# EAGLE design BoomOtter (EAGLE 7.4.0)
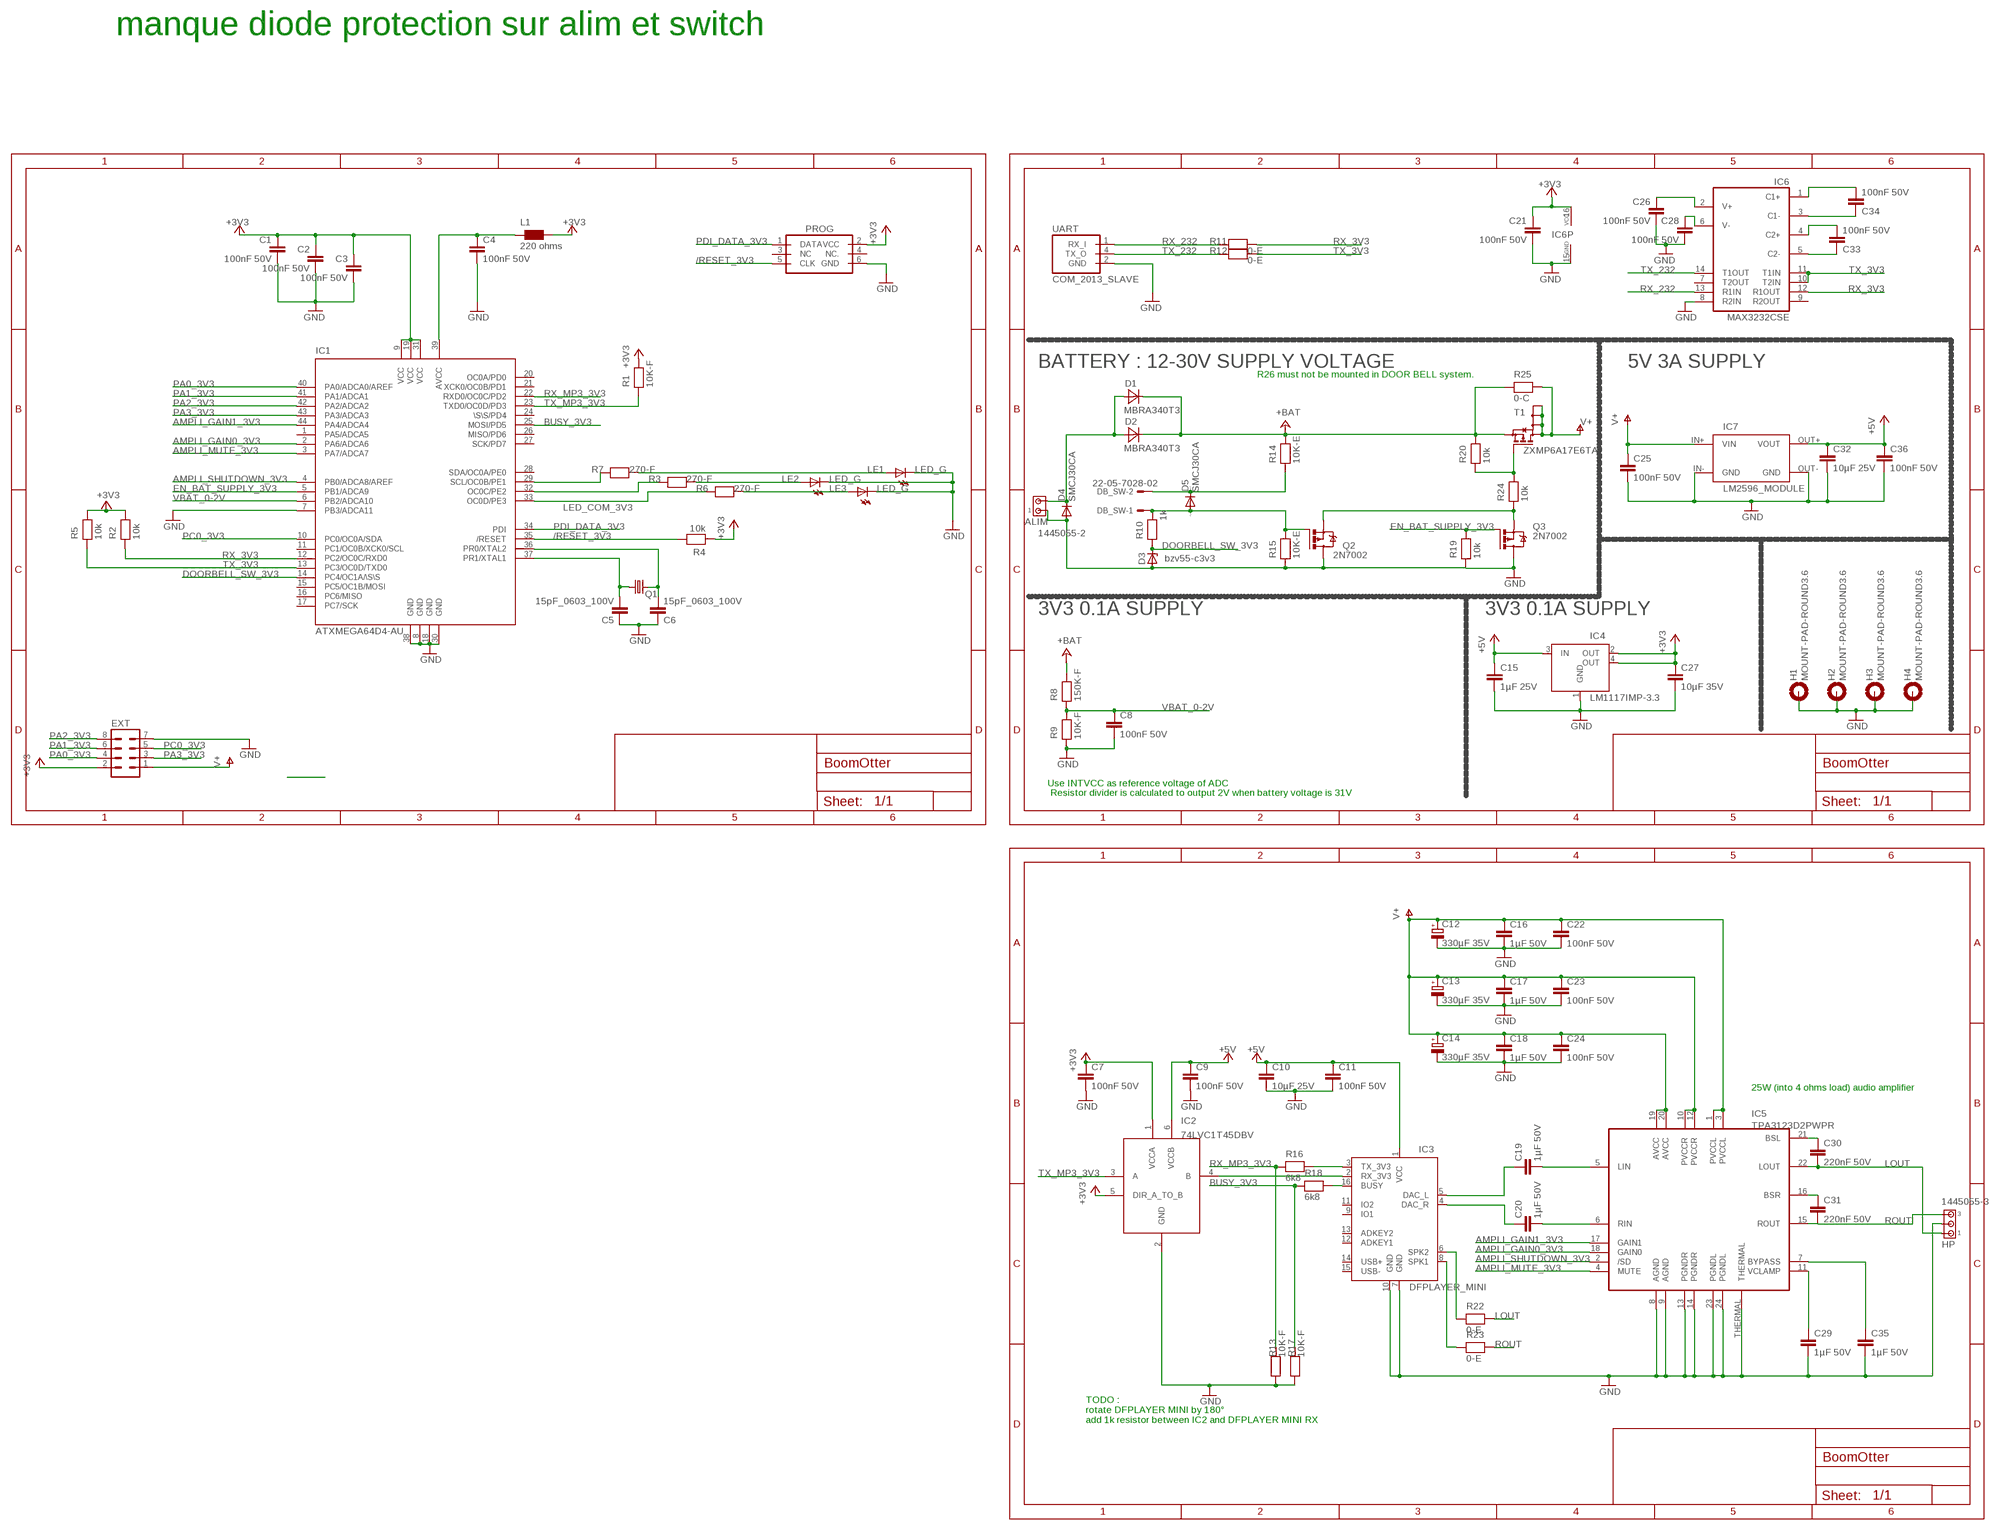
[diagram p0: schematic, sheet 1]

## Parts
ALIM  1445055-2  [1445055-2]
C1  100nF 50V  100NF-F  [C0603]
C2  100nF 50V  100NF-F  [C0603]
C3  100nF 50V  100NF-F  [C0603]
C4  100nF 50V  100NF-F  [C0603]
C5  15pF_0603_100V  15PF-F  [C0603]
C6  15pF_0603_100V  15PF-F  [C0603]
C7  100nF 50V  100NF-F  [C0603]
C8  100nF 50V  100NF-E  [C0805]
C9  100nF 50V  100NF-F  [C0603]
C10  10µF 25V  10UF-C_25V  [C1210]
C11  100nF 50V  100NF-F  [C0603]
C12  330µF 35V  330UF  [PANASONIC_G]
C13  330µF 35V  330UF  [PANASONIC_G]
C14  330µF 35V  330UF  [PANASONIC_G]
C15  1µF 25V  1UFD_25V  [C1206]
C16  1µF 50V  1UFD_50V  [C1206]
C17  1µF 50V  1UFD_50V  [C1206]
C18  1µF 50V  1UFD_50V  [C1206]
C19  1µF 50V  1UFD_50V  [C1206]
C20  1µF 50V  1UFD_50V  [C1206]
C21  100nF 50V  100NF-F  [C0603]
C22  100nF 50V  100NF-F  [C0603]
C23  100nF 50V  100NF-F  [C0603]
C24  100nF 50V  100NF-F  [C0603]
C25  100nF 50V  100NF-E  [C0805]
C26  100nF 50V  100NF-F  [C0603]
C27  10µF 35V  10UF-C_35V  [C1210]
C28  100nF 50V  100NF-F  [C0603]
C29  1µF 50V  1UFD_50V  [C1206]
C30  220nF 50V  220NF-F_50V  [C0805]
C31  220nF 50V  220NF-F_50V  [C0805]
C32  10µF 25V  10UF-C_25V  [C1210]
C33  100nF 50V  100NF-F  [C0603]
C34  100nF 50V  100NF-F  [C0603]
C35  1µF 50V  1UFD_50V  [C1206]
C36  100nF 50V  100NF-F  [C0603]
D1  MBRA340T3  [SMA]
D2  MBRA340T3  [SMA]
D3  bzv55-c3v3  BZV55-C3V3SOD80C  [SOD80C]
D4  SMCJ30CA  DIODE-SMC  [SMC]
D5  SMCJ30CA  DIODE-SMC  [SMC]
DB_SW  22-05-7028-02  [7395-02]
EXT  MA04-2  [MA04-2]
H1  MOUNT-PAD-ROUND3.6  [3,6-PAD]
H2  MOUNT-PAD-ROUND3.6  [3,6-PAD]
H3  MOUNT-PAD-ROUND3.6  [3,6-PAD]
H4  MOUNT-PAD-ROUND3.6  [3,6-PAD]
HP  1445055-3  [1445055-3]
IC1  ATXMEGA64D4-AU  [TQFP44]
IC2  74LVC1T45DBV  [SOT23-6]
IC3  DFPLAYER_MINI  [DFPLAYER_MINI]
IC4  LM1117IMP-3.3  [SOT223]
IC5  TPA3123D2PWPR  [HTSSOP24]
IC6  MAX3232CSE  [SO16]
IC7  LM2596_MODULE  [LM2596]
L1  220 ohms  FERRITE_220OHMS  [R0603]
LE1  LED_G  [CHIP-LED0805]
LE2  LED_G  [CHIP-LED0805]
LE3  LED_G  [CHIP-LED0805]
PROG  PDI_ATMELL  [ML6L]
Q1  CRYSTAL_16MHZ_5032  [CRYSTAL_5032]
Q2  2N7002  [SOT23]
Q3  2N7002  [SOT23]
R1  10K-F  [R0603]
R2  10k  10K-F  [R0603]
R3  270-F  [R0603]
R4  10k  10K-F  [R0603]
R5  10k  10K-F  [R0603]
R6  270-F  [R0603]
R7  270-F  [R0603]
R8  150K-F  [R0603]
R9  10K-F  [R0603]
R10  1k  1K-F  [R0603]
R11  0-E  [R0805]
R12  0-E  [R0805]
R13  10K-F  [R0603]
R14  10K-E  [R0805]
R15  10K-E  [R0805]
R16  6k8  6K8-F  [R0603]
R17  10K-F  [R0603]
R18  6k8  6K8-F  [R0603]
R19  10k  10K-F  [R0603]
R20  10k  10K-F  [R0603]
R22  0-E  [R0805]
R23  0-E  [R0805]
R24  10k  10K-F  [R0603]
R25  0-C  [R1210]
T1  ZXMP6A17E6TA  [SOT26]
UART  COM_2013_SLAVE  [MICROMATCH-4_SMD]

## Nets
+3V3: C1.1 C2.1 C3.1 C7.1 C21.1 C27.1 EXT.2 IC1.9(VCC) IC1.19(VCC) IC1.31(VCC) IC2.1(VCCA) IC2.5(DIR_A_TO_B) IC4.2(OUT) IC4.4(OUT) IC6.16(VCC) L1.2 PROG.2(VCC) R1.2 R2.2 R4.1 R5.2
+5V: C9.1 C10.1 C11.1 C15.1 C32.1 C36.1 IC2.6(VCCB) IC3.1(VCC) IC4.3(IN) IC7.OUT+(VOUT)
+BAT: D1.C D2.C R8.2 R14.2 R20.2 R25.1 T1.4(S)
/RESET_3V3: IC1.35(/RESET) PROG.5(CLK) R4.2
AMPLI_GAIN0_3V3: IC1.2(PA6/ADCA6) IC5.18(GAIN0)
AMPLI_GAIN1_3V3: IC1.44(PA4/ADCA4) IC5.17(GAIN1)
AMPLI_MUTE_3V3: IC1.3(PA7/ADCA7) IC5.4(MUTE)
AMPLI_SHUTDOWN_3V3: IC1.4(PB0/ADCA8/AREF) IC5.2(/SD)
BUSY_3V3: IC1.25(MOSI/PD5) R17.2 R18.1
DOORBELL_SW_3V3: D3.C IC1.14(PC4/OC1A/\S\S) R10.1
EN_BAT_SUPPLY_3V3: IC1.5(PB1/ADCA9) Q3.1(G) R19.2
GND: ALIM.1 C1.2 C2.2 C3.2 C4.2 C5.1 C6.1 C7.2 C8.2 C9.2 C10.2 C11.2 C12.- C13.- C14.- C15.2 C16.2 C17.2 C18.2 C21.2 C22.2 C23.2 C24.2 C25.2 C26.2 C27.2 C28.2 C29.2 C32.2 C35.2 C36.2 D3.A D4.A EXT.7 H1.B3,6(MOUNT) H2.B3,6(MOUNT) H3.B3,6(MOUNT) H4.B3,6(MOUNT) HP.2 IC1.7(PB3/ADCA11) IC1.8(GND) IC1.18(GND) IC1.30(GND) IC1.38(GND) IC2.2(GND) IC3.7(GND) IC3.10(GND) IC4.1(GND) IC5.8(AGND) IC5.9(AGND) IC5.13(PGNDR) IC5.14(PGNDR) IC5.23(PGNDL) IC5.24(PGNDL) IC5.THERMAL IC6.8(R2IN) IC6.15(GND) IC7.IN-(GND) IC7.OUT-(GND) LE1.C LE2.C LE3.C PROG.6(GND) Q2.2(D) Q3.2(D) R9.1 R13.1 R15.1 R17.1 R19.1 UART.2(GND)
LED_COM_3V3: IC1.29(SCL/OC0B/PE1) R7.1
LOUT: C30.2 HP.1 IC5.22(LOUT) R22.2
N$1: C34.1 IC6.1(C1+)
N$2: LE2.A R3.2
N$3: ALIM.2 D1.A D2.A D4.C
N$4: LE3.A R6.2
N$5: C34.2 IC6.3(C1-)
N$6: C33.1 IC6.4(C2+)
N$7: LE1.A R7.2
N$8: Q2.3(S) Q3.3(S) R24.1
N$9: IC1.32(OC0C/PE2) R3.1
N$10: IC1.33(OC0D/PE3) R6.1
N$11: C26.1 IC6.2(V+)
N$12: C19.1 IC3.5(DAC_L)
N$13: C28.1 IC6.6(V-)
N$14: C6.2 IC1.36(PR0/XTAL2) Q1.2
N$15: D5.C DB_SW.2 R14.1
N$16: C4.1 IC1.39(AVCC) L1.1
N$17: D5.A DB_SW.1 Q2.1(G) R10.2 R15.2
N$19: C20.1 IC3.4(DAC_R)
N$20: C20.2 IC5.6(RIN)
N$21: C19.2 IC5.5(LIN)
N$22: C30.1 IC5.21(BSL)
N$23: IC3.3(TX_3V3) R16.2
N$24: C33.2 IC6.5(C2-)
N$25: C31.1 IC5.16(BSR)
N$27: C35.1 IC5.7(BYPASS)
N$28: IC3.6(SPK2) R22.1
N$29: IC3.8(SPK1) R23.1
N$30: IC3.16(BUSY) R18.2
N$33: IC2.4(B) IC3.2(RX_3V3)
N$45: C5.2 IC1.37(PR1/XTAL1) Q1.1
N$128: R20.1 R24.2 T1.3(G)
PA0_3V3: EXT.4 IC1.40(PA0/ADCA0/AREF)
PA1_3V3: EXT.6 IC1.41(PA1/ADCA1)
PA2_3V3: EXT.8 IC1.42(PA2/ADCA2)
PA3_3V3: EXT.3 IC1.43(PA3/ADCA3)
PC0_3V3: EXT.5 IC1.10(PC0/OC0A/SDA)
PDI_DATA_3V3: IC1.34(PDI) PROG.1(DATA)
ROUT: C31.2 HP.3 IC5.15(ROUT) R23.2
RX_3V3: IC1.12(PC2/OC0C/RXD0) IC6.12(R1OUT) R2.1 R11.2
RX_232: IC6.13(R1IN) R11.1 UART.1(RX_I)
RX_MP3_3V3: IC1.22(RXD0/OC0C/PD2) R13.2 R16.1
TX_3V3: IC1.13(PC3/OC0D/TXD0) IC6.10(T2IN) IC6.11(T1IN) R5.1 R12.2
TX_232: IC6.14(T1OUT) R12.1 UART.4(TX_O)
TX_MP3_3V3: IC1.23(TXD0/OC0D/PD3) IC2.3(A) R1.1
V+: C12.+ C13.+ C14.+ C16.1 C17.1 C18.1 C22.1 C23.1 C24.1 C25.1 EXT.1 IC5.1(PVCCL) IC5.3(PVCCL) IC5.10(PVCCR) IC5.12(PVCCR) IC5.19(AVCC) IC5.20(AVCC) IC7.IN+(VIN) R25.2 T1.1(D) T1.2(D) T1.5(D) T1.6(D)
VBAT_0-2V: C8.1 IC1.6(PB2/ADCA10) R8.1 R9.2
VCLAMP: C29.1 IC5.11(VCLAMP)
Unconnected: IC1.1(PA5/ADCA5) IC1.11(PC1/OC0B/XCK0/SCL) IC1.15(PC5/OC1B/MOSI) IC1.16(PC6/MISO) IC1.17(PC7/SCK) IC1.20(OC0A/PD0) IC1.21(XCK0/OC0B/PD1) IC1.24(\S\S/PD4) IC1.26(MISO/PD6) IC1.27(SCK/PD7) IC1.28(SDA/OC0A/PE0) IC3.9(IO1) IC3.11(IO2) IC3.12(ADKEY1) IC3.13(ADKEY2) IC3.14(USB+) IC3.15(USB-) IC6.7(T2OUT) IC6.9(R2OUT) PROG.3(NC) PROG.4(NC.)

## Notes on the sheet
- manque diode protection sur alim et switch
- BATTERY : 12-30V SUPPLY VOLTAGE | 5V 3A SUPPLY
- R26 must not be mounted in DOOR BELL system.
- 3V3 0.1A SUPPLY | 3V3 0.1A SUPPLY
- Use INTVCC as reference voltage of ADC
- Resistor divider is calculated to output 2V when battery voltage is 31V
- 25W (into 4 ohms load) audio amplifier
- TODO : 
  rotate DFPLAYER MINI by 180°
  add 1k resistor between IC2 and DFPLAYER MINI RX

## Library data of the parts
ALIM = robotter_connector:1445055-2: Micro MATE-N-LOK Connectors grid 1.5 mm Source: ENG_CD_1445055_A.pdf; MOUSER: 571-2-1445055-2; RS: 495-9580
C1-C4 C7 C9 C11 C21-C24 C26 C28 C33 C34 C36 = robotter_capacitor:100NF; MOUSER: 81-GRM188F51H104ZA01; RS: 723-5534
C5 C6 = robotter_capacitor:15PF; MOUSER: 581-06031A150K4T2A; RS: 147-421
C8 C25 = robotter_capacitor:100NF; MOUSER: 81-GRM40Y104Z50D; RS: 220-7966
C10 C32 = robotter_capacitor:10UF; MOUSER: 963-TMK316BJ106KL-T; RS: 766-1185
C12-C14 = robotter_capacitor:330UF; MANUFACTURER: EEEFK1V331P; MOUSER: 667-EEE-FK1V331P; RS: 708-3475
C15 = robotter_capacitor:1UF; MOUSER: 810-C3216X7R1E105K-6; RS: 740-7574
C16-C20 C29 C35 = robotter_capacitor:1UF; RS: 601-0334
C27 = robotter_capacitor:10UF; MOUSER: 963-GMK325BJ106MN-T; RS: 758-3325
C30 C31 = robotter_capacitor:220NF; RS: 600-9378
D1 D2 = robotter_diode:MBRA340T3: Surface Mount Schottky Power Rectifier Source: http://www.onsemi.com/pub_link/Collateral/MBRA340T3-D.PDF; MOUSER: 863-MBRA340T3G; RS: 688-0502
D3 = robotter_diode:BZV55-C3V3: Z-Diode; MOUSER: 771-BZV55-C3V3T/R; RS: 748-5029
D4 D5 = diode:DIODE-: DIODE
DB_SW = robotter_connector:22-?-02: CONNECTOR wire to board 2.54 mm (.1 inch) pitch header; OC_FARNELL: 9731601; OC_NEWARK: unknown
EXT = con-lstb:MA04-2: PIN HEADER; OC_FARNELL: unknown; OC_NEWARK: unknown
H1-H4 = holes:MOUNT-PAD-ROUND: MOUNTING PAD, round
HP = robotter_connector:1445055-3: Micro MATE-N-LOK Connectors grid 1.5 mm Source: ENG_CD_1445055_A.pdf; FARNELL: 1111119; MOUSER: 571-2-1445055-3; RS: 495-9596
IC1 = robotter_ic:ATXMEGA64D4; MOUSER: 556-ATXMEGA64D4-AU; VALUE: ATXMEGA64DA-AU
IC2 = robotter_ic:74LVC1T45; MOUSER: 595-SN74LVC1T45DBVT; RS: 662-8825
IC3 = robotter_module:DFPLAYER_MINI
IC4 = robotter_ic:LM1117: equivalent : ams1117
IC5 = robotter_ic:TPA3123D2PWPR
IC6 = robotter_ic:MAX3232: True RS-232 Transceivers 3.0V to 5.5V, Low-Power up to 1Mbps, Using Four 0.1µF External Capacitors Source: http://pdfserv.maxim-ic.com/en/ds/MAX3222-MAX3241.pdf; MOUSER: 511-ST3232CDR; RS: 415-2105
IC7 = robotter_module:LM2596_MODULE
L1 = robotter_inductor:FERRITE_220OHMS; MOUSER: 81-BLM18BB221SN1D; RS: 724-1302
LE1-LE3 = robotter_diode:LED_; MOUSER: 859-LTST-C171GKT; RS: 692-0935; VALUE: GREEN
PROG = robotter_connector:PDI_ATMEL: Ref Harting : 09 18 506 7323 Atmel pdi connector; MOUSER: 617-09-18-506-7323; RS: 693-5242
Q1 = robotter_ic:CRYSTAL_: CRYSTAL; FARNELL: 2467791
Q2 Q3 = robotter:2N7002
R1 R2 R4 R5 R9 R13 R17 R19 R20 R24 = robotter_resistor:10K; MOUSER: 652-CR0603-JW-103ELF; RS: 740-8899
R3 R6 R7 = robotter_resistor:270; MOUSER: 71-CRCW0603J-270-E3; RS: 679-0071
R8 = robotter_resistor:150K; FARNELL: 1527709; RS: 213-2553
R10 = robotter_resistor:1K; MOUSER: 71-CRCW0603-1.0K-E3; RS: 213-2266
R11 R12 R22 R23 R25 = robotter_resistor:0
R14 R15 = robotter_resistor:10K; MOUSER: 71-CRCW080510K0FKEB; RS: 740-9072
R16 R18 = robotter_resistor:6K8; MOUSER: 652-CR0603-JW-682GLF; RS: 740-8969
T1 = robotter_ic:ZXMP6A17E6TA; FN: 1843775
UART = robotter_connector:COM_2013_SLAVE; MOUSER: 571-7-188275-4; RS: 366-1721

## Board
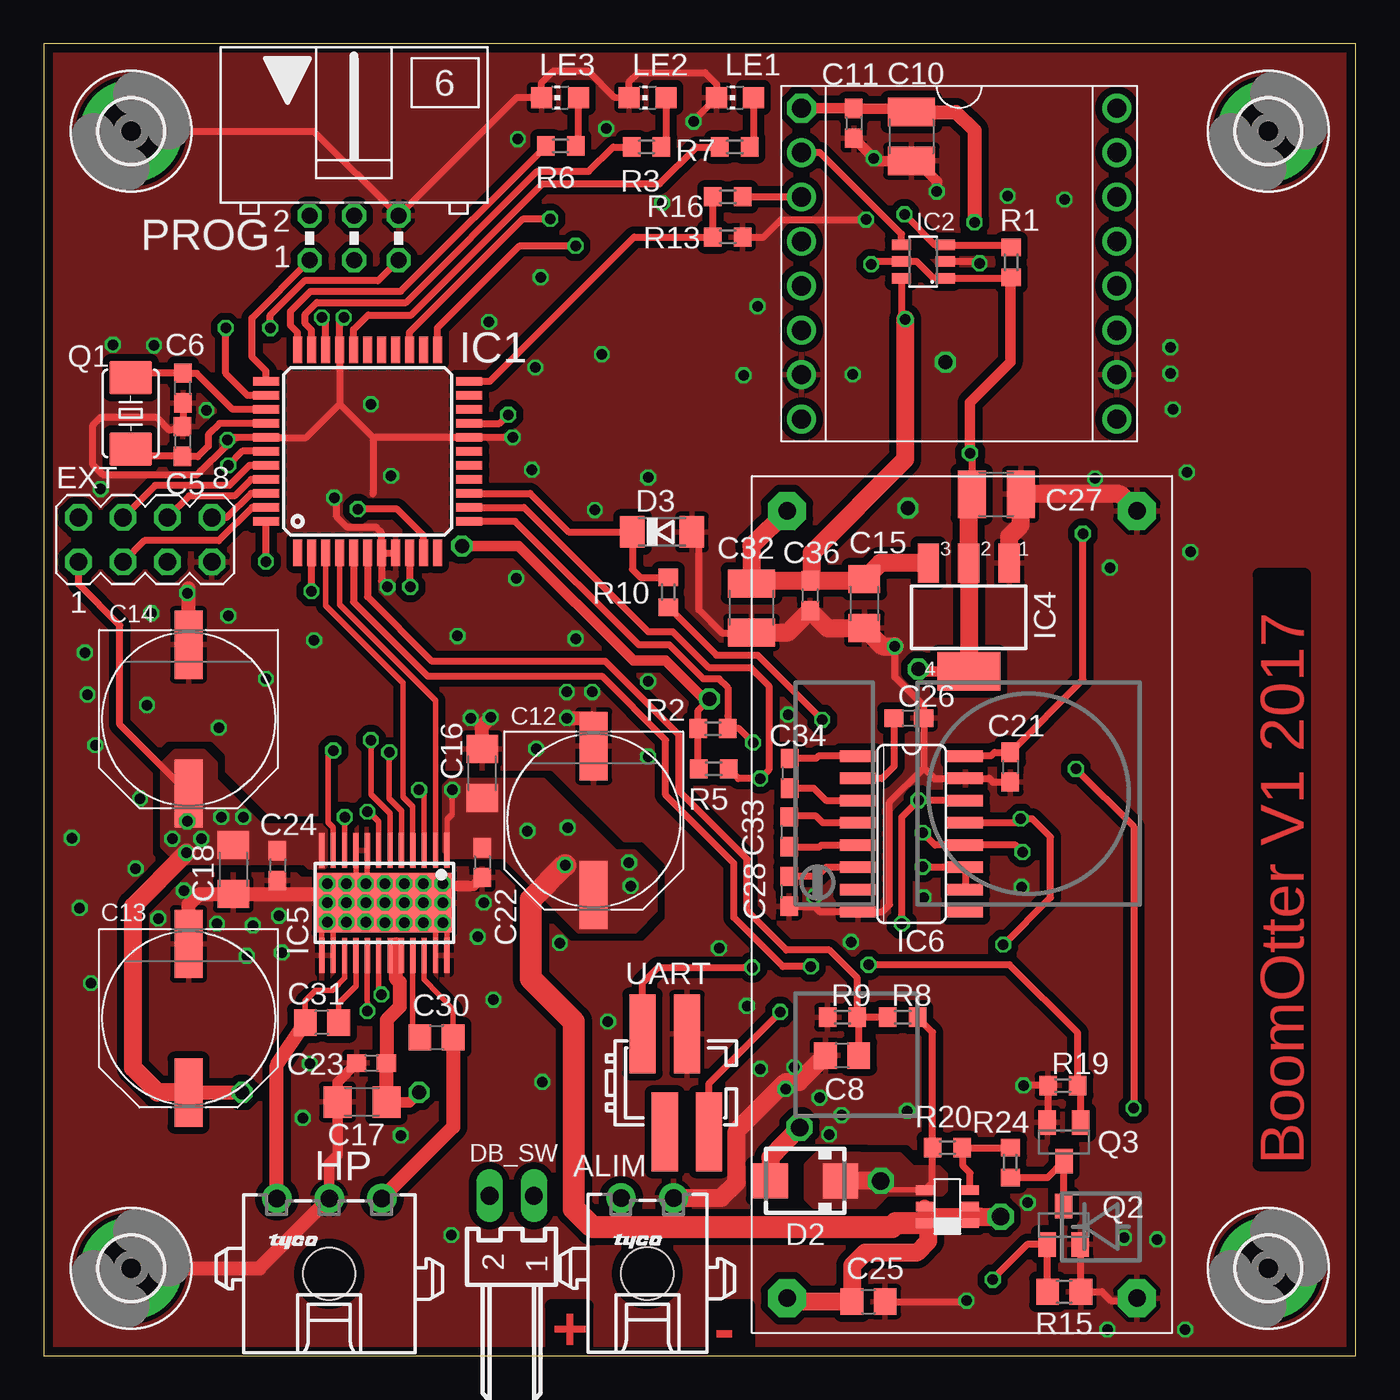
[diagram p1: board, top side]
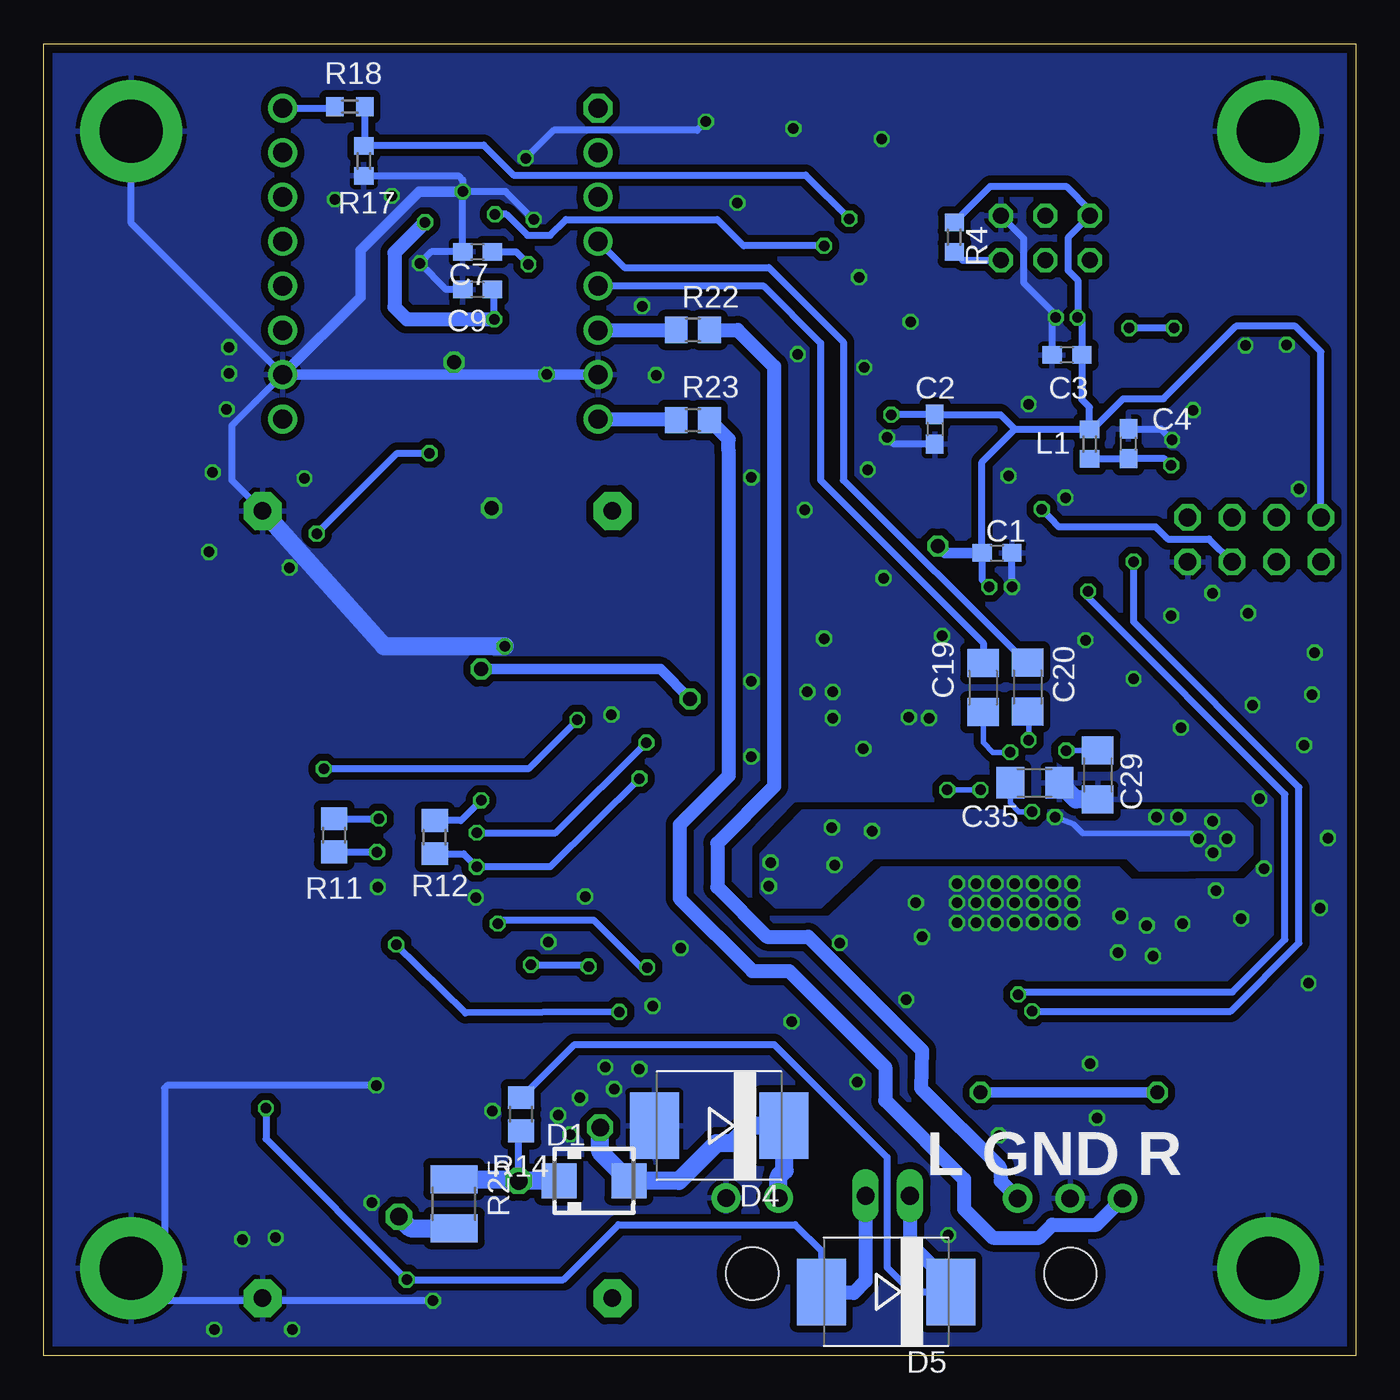
[diagram p2: board, bottom side, seen from below]

Size 75 x 75 mm. Coordinates in mm from the lower left corner, seen from the top.
Outline: 0,0 75,0 75,75 0,75 0,0
Copper layers (1*16): Top 0.035mm / dielectric 1.6mm / Bottom 0.035mm
Design rules "Elecrow_2-layer_PCB_eagle_rule *": minimum track width 6mil, minimum drill 12mil, track to track 6mil, track to pad 8mil, pad to pad 8mil, via to via 12mil, smd to smd 0mil, copper to edge 20mil, drill to drill 10mil, minimum pad ring 6mil, minimum via ring 6mil, stop-mask expansion 0mil, vias tented up to drill 100mil, thermal gap 10mil

### Footprints (pad centres in the part's own frame; a part is rotated, then mirrored left to right if it is on the bottom)
1445055-2 = drill 1 pad 1.676: 1 1.5,4.32; 2 -1.5,4.32 | hole 3: 0,0
C0603 = smd 1.1 x 1: 1 -0.85,0; 2 0.85,0
C0805 = smd 1.3 x 1.5: 1 -0.95,0; 2 0.95,0
C1210 = smd 1.6 x 2.7: 1 -1.4,0; 2 1.4,0
PANASONIC_G = smd 3.9 x 1.6: + 4.25,0; - -4.25,0
C1206 = smd 1.6 x 1.8: 1 -1.4,0; 2 1.4,0
SMA = smd 2 x 2: A 2,0; C -2,0
SOD80C = smd 1.4 x 1.8: A 1.7,0; C -1.7,0
SMC = smd 2.8 x 3.8: A 3.7,0; C -3.7,0
7395-02 = drill 1.016 long: 1 1.27,0; 2 -1.27,0
MA04-2 = drill 1.016 octagon: 1 -3.81,-1.27; 2 -3.81,1.27; 3 -1.27,-1.27; 4 -1.27,1.27; 5 1.27,-1.27; 6 1.27,1.27; 7 3.81,-1.27; 8 3.81,1.27
3,6-PAD = drill 3.6 pad 5.842: B3,6 0,0
1445055-3 = drill 1 pad 1.676: 1 3,4.32; 2 0,4.32; 3 -3,4.32 | hole 3: 0,0
TQFP44 = smd 1.5 x 0.5: 1 -5.8,4; 2 -5.8,3.2; 3 -5.8,2.4; 4 -5.8,1.6; 5 -5.8,0.8; 6 -5.8,0; 7 -5.8,-0.8; 8 -5.8,-1.6; 9 -5.8,-2.4; 10 -5.8,-3.2; 11 -5.8,-4; 23 5.8,-4; 24 5.8,-3.2; 25 5.8,-2.4; 26 5.8,-1.6; 27 5.8,-0.8; 28 5.8,0; 29 5.8,0.8; 30 5.8,1.6; 31 5.8,2.4; 32 5.8,3.2; 33 5.8,4 | smd 0.5 x 1.5: 12 -4,-5.8; 13 -3.2,-5.8; 14 -2.4,-5.8; 15 -1.6,-5.8; 16 -0.8,-5.8; 17 0,-5.8; 18 0.8,-5.8; 19 1.6,-5.8; 20 2.4,-5.8; 21 3.2,-5.8; 22 4,-5.8; 34 4,5.8; 35 3.2,5.8; 36 2.4,5.8; 37 1.6,5.8; 38 0.8,5.8; 39 0,5.8; 40 -0.8,5.8; 41 -1.6,5.8; 42 -2.4,5.8; 43 -3.2,5.8; 44 -4,5.8
SOT23-6 = smd 0.6 x 1.1: 1 -0.95,-1.25; 2 0,-1.25; 3 0.95,-1.25; 4 0.95,1.25; 5 0,1.25; 6 -0.95,1.25
DFPLAYER_MINI = drill 1.1 octagon: 1 -8.89,-9.017 | drill 1.1: 2 -6.35,-9.017; 3 -3.81,-9.017; 4 -1.27,-9.017; 5 1.27,-9.017; 6 3.81,-9.017; 7 6.35,-9.017; 8 8.89,-9.017; 9 8.89,9.017; 10 6.35,9.017; 11 3.81,9.017; 12 1.27,9.017; 13 -1.27,9.017; 14 -3.81,9.017; 15 -6.35,9.017; 16 -8.89,9.017
SOT223 = smd 1.219 x 2.235: 1 -2.311,-3.099; 2 0,-3.099; 3 2.311,-3.099 | smd 3.6 x 2.2: 4 0,3.099
HTSSOP24 = smd 0.3 x 2: 1 -3.575,-3; 2 -2.925,-3; 3 -2.275,-3; 4 -1.625,-3; 5 -0.975,-3; 6 -0.325,-3; 7 0.325,-3; 8 0.975,-3; 9 1.625,-3; 10 2.275,-3; 11 2.925,-3; 12 3.575,-3; 13 3.575,3; 14 2.925,3; 15 2.275,3; 16 1.625,3; 17 0.975,3; 18 0.325,3; 19 -0.325,3; 20 -0.975,3; 21 -1.625,3; 22 -2.275,3; 23 -2.925,3; 24 -3.575,3 | smd 7.8 x 3.4: THERMAL 0,0
SO16 = smd 0.66 x 2.032: 1 -4.445,-3.073; 2 -3.175,-3.073; 3 -1.905,-3.073; 4 -0.635,-3.073; 5 0.635,-3.073; 6 1.905,-3.073; 7 3.175,-3.073; 8 4.445,-3.073; 9 4.445,3.073; 10 3.175,3.073; 11 1.905,3.073; 12 0.635,3.073; 13 -0.635,3.073; 14 -1.905,3.073; 15 -3.175,3.073; 16 -4.445,3.073
LM2596 = drill 1 pad 2.184 octagon: IN+ -22.5,10; IN- -22.5,-10; OUT+ 22.5,10; OUT- 22.5,-10
R0603 = smd 1 x 1.1: 1 -0.85,0; 2 0.85,0
CHIP-LED0805 = smd 1.2 x 1.2: A 0,-1.05; C 0,1.05
ML6L = drill 0.914 octagon: 1 -2.54,-1.27; 2 -2.54,1.27; 3 0,-1.27; 4 0,1.27; 5 2.54,-1.27; 6 2.54,1.27
CRYSTAL_5032 = smd 1.9 x 2.4: 1 -2.05,0; 2 2.05,0
SOT23 = smd 1 x 1.4: 1 -0.95,-1.1; 2 0.95,-1.1; 3 0,1.1
R0805 = smd 1.3 x 1.5: 1 -0.95,0; 2 0.95,0
R1210 = smd 1.6 x 2.7: 1 -1.4,0; 2 1.4,0
SOT26 = smd 0.55 x 1: 1 -0.95,-1.3; 2 0,-1.3; 3 0.95,-1.3; 4 0.95,1.3; 5 0,1.3; 6 -0.95,1.3
MICROMATCH-4_SMD = smd 1.5 x 4.5: 1 1.905,-2.794; 2 0.635,2.794; 3 -0.635,-2.794; 4 -1.905,2.794

### Placement (x,y rotation side)
ALIM  34.5,4.7 0 top
C1  20.51,45.89 0 bottom
C2  24.06,52.97 270 bottom
C3  16.51,57.21 180 bottom
C4  12.99,52.13 90 bottom
C5  7.94,52.27 270 top
C6  7.96,55.32 90 top
C7  50.2,63.1 180 bottom
C8  45.64,17.16 180 top
C9  50.2,60.95 180 bottom
C10  49.6,69.7 270 top
C11  46.3,70.45 270 top
C12  31.43,30.6 270 top
C13  8.28,19.3 270 top
C14  8.28,36.4 270 top
C15  46.9,43 270 top
C16  25.06,33.3 90 top
C17  18.19,14.51 180 top
C18  10.84,27.8 270 top
C19  21.31,38.19 270 bottom
C20  18.76,38.23 270 bottom
C21  55.25,33.65 270 top
C22  25.07,28.2 270 top
C23  18.73,16.73 180 top
C24  13.37,28.02 270 top
C25  47.15,3.1 0 top
C26  49.45,36.45 0 top
C27  54.45,49.25 0 top
C28  42.6,26.55 270 top
C29  14.75,33.2 270 bottom
C30  22.45,18.2 0 top
C31  15.9,19.05 180 top
C32  40.45,42.75 270 top
C33  42.6,29.95 270 top
C34  42.65,33.3 270 top
C35  18.35,32.75 0 bottom
C36  43.8,43.45 270 top
D1  43.55,10.01 0 bottom
D2  43.53,9.99 180 top
D3  35.35,47.1 0 top
D4  36.4,13.15 180 bottom
D5  26.85,3.65 180 bottom
DB_SW  26.75,9.15 0 top
EXT  5.8,46.65 0 top
H1  5,70 0 top
H2  70,70 0 top
H3  70,5 0 top
H4  5,5 0 top
HP  16.32,4.68 0 top
IC1  18.51,51.7 90 top
IC2  50.28,62.55 90 top
IC3  52.33,62.43 270 top
IC4  52.88,42.22 180 top
IC5  19.47,25.89 180 top
IC6  49.61,29.83 270 top
IC7  52.49,25.79 90 top
L1  15.22,52.12 90 bottom
LE1  39.52,71.92 90 top
LE2  34.52,71.92 90 top
LE3  29.51,71.92 90 top
PROG  17.74,63.89 0 top
Q1  4.97,53.87 90 top
Q2  58.3,7.47 0 top
Q3  58.32,12.23 180 top
R1  55.3,62.5 270 top
R2  38.25,35.85 180 top
R3  34.45,69.1 0 top
R4  22.95,63.95 270 bottom
R5  38.3,33.55 180 top
R6  29.55,69.15 0 top
R7  39.5,69.1 0 top
R8  49.1,19.35 0 top
R9  45.65,19.35 0 top
R10  35.7,43.65 270 top
R11  58.4,29.75 270 bottom
R12  52.65,29.65 270 bottom
R13  39.1,63.95 180 top
R14  47.71,13.81 270 bottom
R15  58.33,3.66 180 top
R16  39.1,66.25 0 top
R17  56.7,68.3 90 bottom
R18  57.5,71.4 180 bottom
R19  58.25,15.45 0 top
R20  51.65,11.9 180 top
R22  37.89,58.64 0 bottom
R23  37.89,53.49 0 bottom
R24  55.25,11.05 90 top
R25  51.55,8.7 270 bottom
T1  51.65,8.53 90 top
UART  36.13,15.6 0 top

### Tracks (layer width: path | path; a pad name or v marks a point on that pad's centre or on a via)
+3V3  (via drill 0.6, 0.8)
  Top 0.406: R1.2 55.25,61.6 IC2.1 50.85,61.6 49.9,62.55 IC2.5 47.45,62.55 v47.3,62.4 | IC6.16 52.71,34.3 54.15,34.3 54.35,34.5 C21.1 59.4,38.65 v59.4,47 | IC1.31 16.11,59.14 v15.9,59.35 | IC1.9 20.91,43.99 v20.95,43.95 | IC1.19 26.05,53.3 v26.55,53.8 | 52.71,38.95 IC4.4 | v52.95,51.6 53.05,51.5 C27.1 | R2.2 37.45,35.8 | R5.2 37.4,33.6 R2.2 | R2.2 37.4,36.9 v38.05,37.55
  Top 0.61: v50,39.25 50.13,39.12 IC4.4 | v38.05,37.55 37.75,37.55 35.55,39.75 33.7,39.75 27.15,46.3 v23.9,46.3 | 55.25,61.6 55.25,56.8 52.95,54.5 v52.95,51.6
  Top 1.016: C27.1 52.88,49.08 IC4.2 IC4.4
  Bottom 0.406: R4.1 20.9,66.85 16.55,66.85 15.2,65.5 PROG.2 16.45,63.91 16.45,62.05 15.9,61.5 v15.9,59.35 15.66,59.11 C3.1 15.66,54.66 15.22,54.22 L1.2 | v20.95,43.95 21.36,44.36 C1.1 21.36,51.09 19.48,52.97 | 19.48,52.97 L1.2 | 24.08,53.8 C2.1 | 24.08,53.8 20.31,53.8 19.48,52.97 | 24.08,53.8 v26.55,53.8 | C7.1 48,63.1 v47.3,62.4 | v59.4,47 54.8,51.6 v52.95,51.6 | EXT.2 1.99,57.39 3.45,58.85 6.85,58.85 11,54.7 13.3,54.7 15.03,52.97 L1.2
  Bottom 0.61: v38.05,37.55 39.75,39.25 v50,39.25 | v23.9,46.3 23.49,45.89 C1.1
+5V  (via drill 0.6)
  Top 0.406: IC2.6 49.03,59.47 v49.25,59.25
  Top 0.61: C10.1 49.1,71.3 C11.1 46.28,71.32 IC3.1
  Top 0.813: C10.1 52.15,71.1 53.2,70.05 v53.2,64.8
  Top 1.016: IC4.3 47.82,45.32 C15.1 46.8,44.3 C36.1 | C36.1 43.9,44.4 43.9,45.9 49.25,51.25 v49.25,59.25 | C36.1 40,44.3 C32.1 40.45,46.3 IC7.OUT+
  Bottom 0.406: v49.25,59.25 49.25,60.85 C9.1
  Bottom 0.813: v53.2,64.8 54.95,63.05 54.95,59.95 54.25,59.25 v49.25,59.25
+BAT  (via drill 1)
  Top 0.305: 47.9,10 48.42,9.48 T1.4 50.8,9.93
  Top 0.406: 50.8,9.93 R20.2 50.8,18.5 R8.2
  Top 1.016: v47.85,10 D2.C
  Bottom 0.406: v47.85,10 47.85,12.72 R14.2
  Bottom 1.016: D1.C v47.84,10.01 v47.85,10 47.95,10.1 R25.1
  pour Top (no thermals): 44.45,11.55 48.9,11.5 49.65,10.75 51.15,10.75 51.55,10.35 51.55,9.5 51.3,9.25 48.2,9.25 47.5,8.55 44.05,8.55 43.6,9 43.6,10.9 44.25,11.55
/RESET_3V3  (via drill 0.6)
  Top 0.406: IC1.35 11.65,54.9 10.4,56.15 v10.4,58.75 | v12.95,58.75 12.95,59.5 14.9,61.45 19.11,61.45 PROG.5
  Bottom 0.406: R4.2 22.47,62.62 PROG.5 | v10.4,58.75 v12.95,58.75
AMPLI_GAIN0_3V3  (via drill 0.6)
  Top 0.305: IC5.18 19.14,20.8 v19.3,20.65
  Top 0.406: v15.3,43.7 v15.31,43.71 IC1.2
  Bottom 0.305: v19.3,20.65 19.15,20.8
  Bottom 0.406: 19.15,20.8 7.05,20.8 4.05,23.8 4.05,32.1 15.3,43.35 v15.3,43.7
AMPLI_GAIN1_3V3  (via drill 0.6)
  Top 0.305: IC5.17 18.5,20.8 v18.5,19.7
  Top 0.406: v12.7,45.4 v12.71,45.41 IC1.44
  Bottom 0.406: v18.5,19.7 7.15,19.7 3.25,23.6 3.25,32.5 12.7,41.95 v12.7,45.4
AMPLI_MUTE_3V3
  Top 0.305: IC1.3 16.11,42.89 20.43,38.58 20.55,38.45 20.55,31.95 21.09,31.41 IC5.4
AMPLI_SHUTDOWN_3V3
  Top 0.305: IC1.4 16.91,42.94 22.39,37.45 IC5.2
BUSY_3V3  (via drill 0.6)
  Top 0.406: IC1.25 20.91,58.51 27.4,65 v28.95,65
  Bottom 0.406: R18.1 56.65,69.2 | 56.65,69.2 R17.2 | 56.65,69.2 49.85,69.2 48.15,67.5 31.45,67.5 v28.95,65
DOORBELL_SW_3V3
  Top 0.406: IC1.14 27.8,49.3 30,47.1 D3.C 33.65,44.95 34.1,44.5 R10.1
EN_BAT_SUPPLY_3V3  (via drill 0.6)
  Top 0.406: IC1.5 17.71,43.09 21.95,38.85 31.9,38.85 35.55,35.2 35.55,32.05 39.45,28.15 39.45,25.05 42.25,22.25 v43.85,22.25 | Q3.1 59.27,15.28 R19.2 59.1,18.45 55.2,22.35 v47.15,22.35
  Bottom 0.406: v47.15,22.35 43.95,22.35 v43.85,22.25
GND  (via drill 0.6, 0.8)
  Top 0.305: IC5.14 16.55,24.95 | 16.55,24.95 17.45,25.85 17.85,25.85 | 17.85,25.85 18.9,25.85 | 18.9,25.85 19.43,25.85 IC5.THERMAL 19.66,25.7 21.7,25.7 | IC5.13 15.89,24.3 16.55,24.95 | IC5.23 22.39,25 21.7,25.7 | IC5.24 23.05,25.11 22.45,25.7 21.7,25.7 | IC5.9 17.84,25.86 17.85,25.85 | IC5.8 18.5,26.25 18.9,25.85 | C24.2 13.37,26.58 13.55,26.4
  Top 0.406: v53.5,62.45 53.4,62.55 IC2.2 | LE2.C 33.47,72.82 34,73.35 37.8,73.35 38.47,72.68 LE1.C 37.15,70.6 v37.15,70.55 | LE2.C 32.6,71.95 31.1,73.45 29.15,73.45 28.46,72.76 LE3.C 27.04,71.92 PROG.6 15.44,70 H1.B3,6 | 33.45,71.93 LE2.C | C25.2 52.7,3.1 v52.75,3.15 | Q2.2 59.25,3.69 R15.1 60.49,3.66 61,3.15 62.35,3.15 IC7.IN- | 57.35,13.31 Q3.2 57.4,13.36 R19.1 v56,15.45 | C28.2 44.05,25.7 44.35,25.4 46.52,25.4 IC6.8 47.94,25.39 48.35,25.8 48.35,31.65 50.3,33.6 | 50.3,33.6 C26.2 50.3,37.15 48.65,38.8 v48.65,40.55 | 50.3,33.6 50.9,33 IC6.15 54.05,33.01 54.25,32.8 C21.2 | C6.1 7.96,52.94 C5.1 7.18,52.92 6.45,53.65 3.25,53.65 2.8,53.2 2.8,50.95 3.4,50.35 8.75,50.35 10.5,52.1 v10.5,52.35 10.65,52.5 IC1.38 15,52.5 16.91,54.41 | v17.15,59.35 16.91,59.11 IC1.30 16.91,54.41 | 18.82,52.5 IC1.18 v26.8,52.5 | 18.82,52.5 16.91,54.41 | 18.82,52.5 18.82,49.28 | IC1.7 19.3,47.05 19,47.35 17.35,47.35 16.75,47.95 16.75,48.9 v16.6,49.05 | IC1.7 IC1.8 | IC1.7 19.31,44.29 v19.65,43.95 | R13.1 41.15,63.95 42.15,64.95 v47,64.95 | C32.2 39.8,41.3 38.8,41.3 37.45,42.65 37.45,46.7 D3.A | 44.8,17.27 C8.2 | R9.1 44.75,19.35 | v19.5,25.9 IC5.THERMAL
  Top 0.61: C11.2 v47.45,68.45 47.6,68.3 C10.2 49.9,68.3 51.05,67.15 v51.05,66.55 | C23.2 16.79,15.64 C17.2 16.79,11.49 16.3,11 16.3,9.02 HP.2 | 23.05,25.11 23.05,26.8 23,26.85 24.57,26.85 C22.2
  Top 0.8: H4.B3,6 12.32,5 HP.2 | C14.- 8.28,43.87 v8.2,43.6
  Top 0.813: C13.- 8.28,25.78 8.9,26.4 C18.2 13.55,26.4 18.96,26.4 IC5.THERMAL | C16.2 25.06,36.01 v25.55,36.5 | v29.9,36.45 31.3,36.45 31.8,35.95 31.8,34.97 C12.-
  Top 1.016: IC7.OUT- 61.53,49.25 C27.2 55.85,47.5 55.19,46.84 IC4.1 | C32.2 42.55,41.35 C36.2 44.8,41.6 C15.2 47.95,40.55 v48.65,40.55 | ALIM.1 38.72,9.02 39.6,9.9 39.6,12.85 42.4,15.65 43.18,15.65 C8.2
  Bottom 0.406: H2.B3,6 70,64.73 IC3.10 64.25,53.18 64.25,50.05 IC7.OUT- | C9.2 52,60.95 v53.5,62.45 52.85,63.1 C7.2 v51.05,66.55 | 62.35,3.15 68.15,3.15 H3.B3,6 | v52.75,3.15 62.35,3.15 | 62.35,3.15 IC7.IN- | R17.1 51.3,67.45 51.05,67.2 v51.05,66.55 | C3.2 17.35,59.15 v17.15,59.35 17.15,59.5 19,61.35 19,63.88 PROG.6 | v19.65,43.95 C1.2 | C2.2 26.42,52.12 v26.8,52.5 | v47,64.95 48.6,66.55 v51.05,66.55 | v37.15,70.55 37.65,70.05 45.85,70.05 v47.45,68.45 | v56,15.45 67.95,15.45 68.1,15.3 68.1,6.9 70.05,4.95 | C4.2 11.13,52.98 v10.5,52.35
  Bottom 0.61: 50.98,66.55 v51.05,66.55 53.55,66.55 56.9,63.2 56.9,60.53 IC3.10 IC3.7
  Bottom 1.016: v48.65,40.55 55.55,40.55 IC7.OUT- | C29.2 16,31.8 C35.2
  other vias: 16.2,27 16.2,25.9 16.2,24.8 17.3,24.8 18.4,24.8 19.5,24.75 20.6,24.75 21.7,24.75 22.8,24.75 22.8,25.9 22.8,27 21.7,27 21.7,25.9 20.6,25.9 20.6,27 19.5,27 18.4,27 18.4,25.9 17.3,25.9 17.3,27 6.15,42.45 10.55,42.3 8,26.6 6.55,25 9.9,24.7 11.95,24.6 13.45,25.15 25.15,25.9 24.4,36.45 29.9,37.95 31.35,37.95 29.5,23.6 25.7,20.35 38.6,23.3 34.55,38.55 34.55,50.2 40.8,60 31.9,57.25 31.5,48.35 34.55,34.25 35.35,65.9 18.7,54.4 19.85,50.3 51.55,56.8 49.4,48.45 46.15,23.65 50.3,26.2 55.9,26.8 44.05,26.25 32.25,19.1 40.2,20 44.9,12.65 49.35,14 56.25,8.75 60.8,1.5 65.25,1.5 63.65,6.65 61.75,6.75 42.55,36.65 15.2,16.7 14.8,13.6 20.4,12.6 27.1,69.55 32.15,70.15 28.4,61.65 25.45,59.1 40,56.05 55.1,66.3 58.35,66.1 64.4,57.65 64.4,56.15 64.55,54.1 46.25,56.1 60.1,50.15 65.35,50.5 65.55,45.95 60.95,45.05 42.4,15.25 40.95,16.4 42.9,16.5 44.35,14.75 45.6,13.75 28.5,15.65 23.3,6.9 30.4,41 23.65,41.15 27,44.45 27.9,50.65 28.1,56.5 6.3,57.75 3.95,57.8 2.95,34.9 2.5,37.8 2.35,40.2 5.9,37.2 10,35.9 12.7,38.7 15.45,40.9 5.5,31.85 5.25,27.85 24.8,23.95 13.6,23.05 11.6,22.85 2.7,21.3 2.05,25.6 1.6,29.6 28.15,34.7 3.25,49.55 9.3,54.05
  pour Top (isolate 0.406, rank 2): 0,0 75,0 75,74.95 0,74.95
  pour Bottom (isolate 0.406, rank 2): 0.05,-0.1 75.05,-0.1 75.05,74.85 0.05,74.85
LED_COM_3V3
  Top 0.406: IC1.29 17.71,58.66 18.55,59.5 21,59.5 28.5,67 35.2,67 37.3,69.1 R7.1
LOUT
  Top 0.305: IC5.22 21.75,21.5 23.4,19.8 C30.2
  Top 0.813: HP.1 23.4,13.08 C30.2
  Bottom 0.8: R22.2 35.34,58.64 33.25,56.55 33.25,32.55 36.5,29.3 36.5,26.8 33.65,23.95 31.3,23.95 24.8,17.45 24.85,15.3 20.35,10.8
  Bottom 0.813: 20.35,10.8 20.3,9.98 HP.1
N$1
  Top 0.406: IC6.1 44.27,34.27 44.15,34.15 C34.1
N$2
  Top 0.406: LE2.A 35.57,69.37 R3.2
N$3  (via drill 1)
  Top 1.016: v43.2,13.05 41.53,11.33 D2.A
  Bottom 1.016: v43.2,13.05 43.2,11.66 D1.A D2.A 38.7,10 36.55,12.15 35.65,12.15 34.65,13.15 D4.C 32.65,13.1 32.65,10.6 33,10.25 ALIM.2
N$4
  Top 0.406: LE3.A 30.55,69.3 R6.2
N$5
  Top 0.406: C34.2 44,32.45 44.7,31.75 46.52,31.75 IC6.3
N$6
  Top 0.406: IC6.4 44.53,30.46 44.15,30.85 42.65,30.85 C33.1
N$7
  Top 0.406: LE1.A 40.57,69.32 R7.2
N$8
  Top 0.406: R24.1 57.39,10.2 Q3.3 58.3,11.11 Q2.3
N$9
  Top 0.406: IC1.32 15.31,58.64 14.95,59 14.95,59.55 15.6,60.2 20.7,60.2 28.2,67.7 31.15,67.7 32.55,69.1 R3.1
N$10
  Top 0.406: IC1.33 14.51,58.49 14.1,58.9 14.1,59.7 15.25,60.85 20.4,60.85 R6.1
N$11
  Top 0.406: C26.1 48.6,33.7 47.9,33 IC6.2
N$12
  Bottom 0.406: IC3.5 33.86,61.16 30.6,57.9 30.6,50.05 21.3,40.75 C19.1
N$13
  Top 0.406: IC6.6 44.73,27.93 44.2,27.4 C28.1
N$14
  Top 0.406: IC1.36 10.8,54.1 8.75,56.15 7.88,56.15 C6.2 5.27,56.17 Q1.2
N$15
  Bottom 0.406: R14.1 47.69,14.76 44.65,17.8 33.25,17.8 26.8,11.35 26.8,5.05 25.4,3.65 D5.C
  Bottom 0.813: DB_SW.2 25.48,6.43 23.8,4.75 23.8,4.3 D5.C
N$16  (via drill 0.6)
  Top 0.406: IC1.39 11.35,51.7 v10.55,50.9
  Bottom 0.406: v10.55,50.9 10.93,51.28 C4.1 L1.1
N$17  (via drill 0.6)
  Top 0.406: R15.2 57.38,6.34 Q2.1 56.22,6.37 54.25,4.4 v54.25,4.35 | R10.2 38.45,40.05 40.8,40.05 v44.5,36.35 | v59,33.55 62.3,30.25 v62.3,14.15
  Bottom 0.406: v44.5,36.35 47.3,33.55 v59,33.55 | v62.3,14.15 62.3,12.4 v54.25,4.35 45.3,4.35 42.15,7.5 32.05,7.5 30.55,6 D5.A
  Bottom 0.813: DB_SW.1 28.02,4.28 28.7,3.6 30.5,3.6 D5.A
N$19
  Bottom 0.406: IC3.4 41.81,62.2 33.55,62.2 29.3,57.95 29.3,50.05 18.75,39.55 C20.1
N$20  (via drill 0.6)
  Top 0.305: IC5.6 19.8,31 18.7,32.1 v18.7,35.2
  Bottom 0.305: v18.7,35.2 18.7,36.77 C20.2
N$21  (via drill 0.6)
  Top 0.305: IC5.5 20.45,31.16 19.75,31.85 v19.75,34.5
  Bottom 0.305: v19.75,34.5 20.75,34.5 21.3,35.05 C19.2
N$22
  Top 0.305: IC5.21 21.09,18.45 C30.1
N$23
  Top 0.406: R16.2 IC3.3
N$24
  Top 0.406: C33.2 44.35,29.1 44.45,29.2 IC6.5
N$25
  Top 0.305: IC5.16 17.84,21.15 16.85,20.16 C31.1
N$27  (via drill 0.6)
  Top 0.305: v18.5,31.1 18.6,31.1 19.14,30.55 | 19.14,30.55 19.15,30.55 | IC5.7 19.14,30.55
  Bottom 0.305: C35.1 19.75,31.6 19.25,31.1 v18.5,31.1
N$28
  Bottom 0.813: IC3.6 39.41,58.62 R22.1
N$29
  Bottom 0.813: IC3.8 39.34,53.54 R23.1
N$30
  Bottom 0.406: IC3.16 58.43,71.32 R18.2
N$33
  Top 0.406: IC2.4 49.03,64.12 44.37,68.78 IC3.2
N$45
  Top 0.406: IC1.37 10.05,53.3 9.4,52.65 9.4,52 8.8,51.4 7.92,51.4 C5.2 5.37,51.42 Q1.1
N$128
  Top 0.406: T1.3 52.95,10.45 52.55,10.85 52.55,11.85 R20.1 R24.2
PA0_3V3
  Top 0.406: IC1.40 11.75,50.9 10.6,49.75 6.36,49.75 EXT.4
PA1_3V3
  Top 0.406: IC1.41 11.85,50.1 10.9,49.15 8.3,49.15 EXT.6
PA2_3V3
  Top 0.406: IC1.42 11.85,49.3 10.47,47.92 EXT.8
PA3_3V3
  Top 0.406: IC1.43 11.9,48.5 10,46.6 5.75,46.6 EXT.3
PC0_3V3  (via drill 0.6)
  Top 0.406: IC1.10 21.71,46.89 20.2,48.4 v17.95,48.4
  Bottom 0.406: v17.95,48.4 17,47.4 11.45,47.4 10.75,46.7 8.39,46.7 EXT.5
PDI_DATA_3V3
  Top 0.406: PROG.1 11.9,59.32 11.9,57.1 12.71,56.29 IC1.34
ROUT
  Top 0.305: IC5.15 17.2,21.59 16.5,20.9 15.55,20.9 14.95,20.3 C31.2
  Top 0.813: HP.3 13.32,16.62 C31.2
  Bottom 0.8: 35.85,51.7 35.85,33.15 38.65,30.35 38.65,26.15 34.5,22 32.4,22 26.9,16.5 26.9,14.6 22.4,10.1 22.4,8.4 20.75,6.75 18.1,6.75 17.35,7.5 14.82,7.5 HP.3
  Bottom 0.813: 35.85,51.7 35.85,52.4 R23.2
RX_3V3  (via drill 0.6)
  Top 0.406: v55.95,28.8 55.55,29.2 IC6.12 50.95,29.2 v50.25,29.9 | IC1.12 26.95,47.7 34,40.65 35.75,40.65 37.7,38.7 38.6,38.7 39.1,38.2 R2.1 | v40.55,35.05 39.75,35.85 R2.1 | 39.1,36.6 R2.1
  Bottom 0.406: R11.2 v55.95,28.8 | v50.25,29.9 45.75,29.9 v40.55,35.05
RX_232  (via drill 0.6)
  Top 0.406: IC6.13 55.62,30.46 v55.85,30.7 56.5,30.7 57.55,29.65 57.55,26.2 v54.85,23.5 | UART.1 38.03,15.59 v42.1,19.65
  Bottom 0.406: R11.1 v55.85,30.7 | v42.1,19.65 50.9,19.6 v54.85,23.5
RX_MP3_3V3
  Top 0.406: R16.1 R13.2 33.75,63.95 25.5,55.7 IC1.22
TX_3V3  (via drill 0.6)
  Top 0.406: v50.25,27.95 52.66,27.95 IC6.11 IC6.10 | IC1.13 27.45,48.5 34.55,41.4 35.95,41.4 38,39.35 40.4,39.35 41.45,38.3 41.45,33.5 v40.95,33 39.7,33 R5.1
  Bottom 0.406: R12.2 51,28.7 v50.25,27.95 46.05,27.95 v40.95,33
TX_232  (via drill 0.6)
  Top 0.406: IC6.14 50.02,31.73 v50,31.75 49.05,30.8 v49.05,24.7 | UART.4 34.23,21.32 35.1,22.2 v40.5,22.2
  Bottom 0.406: v50,31.75 51.15,30.6 R12.1 | v40.5,22.2 40.85,22.2 43.55,24.9 49.05,24.9 v49.05,24.7
TX_MP3_3V3  (via drill 0.6)
  Top 0.406: R1.1 55.15,63.5 IC2.3 50.95,63.5 v49.2,65.25 | IC1.23 22.51,58.76 27.2,63.45 v30.4,63.45
  Bottom 0.406: v30.4,63.45 35,63.45 36.5,64.95 45.15,64.95 46.05,64.05 47.35,64.05 48.55,65.25 v49.2,65.25
V+  (via drill 0.6, 0.8, 1)
  Top 0.305: T1.6 50.35,7.75 50.55,7.95 | T1.2 T1.1 53.18,7.58 53.55,7.95 | IC5.19 IC5.20 20.16,22.89 20.12,22.85 | IC5.3 21.75,32.05 v21.45,32.35 | IC5.1 23.05,30.64 23.35,30.95 v23.35,32.35 | 24.91,28.89 C22.1 | IC5.10 17.2,30.39 v17.2,30.8
  Top 0.406: C14.+ 4.35,36.08 4.35,41.75 1.99,44.11 EXT.1
  Top 0.61: C23.1 | v21.45,15.05 20.9,14.5 C17.1
  Top 0.813: 20.12,23.52 20.12,22.85 20.12,21.57 20.35,21.35 20.35,19.95 19.6,19.2 19.6,16.75 C23.1 C17.1 | T1.5 T1.6 | C13.+ v11.35,15.05
  Top 1.016: IC7.IN+ 42.68,3.1 C25.1 46.2,5.15 46.95,5.9 49.9,5.9 50.55,6.55 50.55,7.95 53.55,7.95 v54.7,7.95 | C13.+ 6.5,15.05 5.1,16.45 5.1,25.7 v8.15,28.75
  Top 1.25: 48.5,7.35 31.38,7.35
  Top 1.27: T1.6 48.7,7.58 48.5,7.35 | 31.38,7.35 30.3,8.4 30.3,19.1 27.85,21.55 27.85,26.1 v29.8,28.05
  Bottom 0.305: v21.45,32.35 v23.35,32.35 | v17.2,30.8 16.15,30.4 15.6,29.85 9.3,29.85 v9,29.55
  Bottom 0.61: v11.35,15.05 v21.45,15.05
  Bottom 1.016: v54.7,7.95 54.05,7.3 R25.2
  other vias: 33.45,28.2 33.55,26.85 7.35,29.55 10.15,30.8 11.4,30.8 8.2,30.55 27.65,30 29.95,30.2
  pour Top (no thermals): 23.25,32.9 28.55,32.9 32.65,28.8 33.75,28.8 34.95,27.6 34.95,25.45 33.8,24.3 30.6,24.3 26.35,28.55 23.2,28.55 22.9,28.85 22.9,32.55
  pour Top (no thermals): 7.75,28.2 14.95,28.2 15.2,27.95 16,27.95 16.15,28.1 16.15,30.05 15.9,30.3 12.4,30.3 9.8,32.9 9.8,33.85 9.1,34.55 7.55,34.55 6.8,33.8 6.8,29.15
  pour Bottom (isolate 0.406, no thermals): 31.55,30.95 33.8,28.6 33.8,26.55 33.1,25.85 30.65,25.85 27.65,28.7 13,28.7 12.25,27.95 6.9,28 6.15,28.75 6.15,30.2 6.9,30.95
VBAT_0-2V
  Top 0.406: R8.1 R9.2 | C8.1 46.59,19.26 R9.2 | R9.2 46.5,21.6 44.9,23.2 42.45,23.2 40.2,25.45 40.2,28.4 36.3,32.3 36.3,35.5 32.1,39.7 22.2,39.7 18.51,43.39 IC1.6
VCLAMP  (via drill 0.6)
  Top 0.305: IC5.11 16.55,30.2 16.25,30.5 16.25,34.3 v16.55,34.6 v16.55,34.59
  Bottom 0.305: v16.55,34.6 C29.1

### Text on the board
Top: BoomOtter V1 2017 | + | -
bPlace: L GND R